# EAGLE schematic Power Supply Gating (EAGLE 9.6.2)
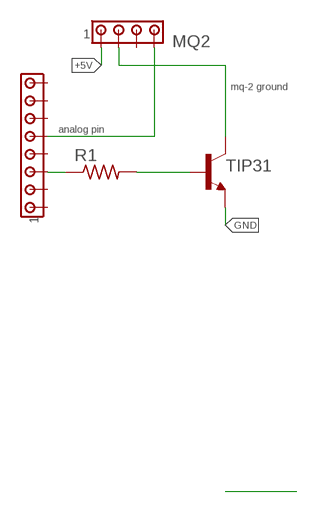
[diagram p0: schematic, sheet 1]

## Parts
MIC_KANAN  MTA08-100  [10X08MTA]
MQ2  MTA04-100  [10X04MTA]
R1  560  R-US_0204/7  [0204/7]
TIP31  2SC1306  [TO220BV]

## Nets
+5V: MQ2.1
ANALOG_PIN: MIC_KANAN.5 MQ2.4
GND: TIP31.3(E)
N$2: MIC_KANAN.3 R1.1
N$16: MQ2.2 TIP31.2(C)
N$19: R1.2 TIP31.1(B)
Unconnected: MIC_KANAN.1 MIC_KANAN.2 MIC_KANAN.4 MIC_KANAN.6 MIC_KANAN.7 MIC_KANAN.8 MQ2.3

## Notes on the sheet
- mq-2 ground
- analog pin

## Library data of the parts
MIC_KANAN = con-amp:MTA08-100: AMP connector
MQ2 = con-amp:MTA04-100: AMP connector
R1 = rcl:R-US_: RESISTOR, American symbol; SPICEPREFIX: R
TIP31 = transistor:2SC1306: NPN Transistor Final RF Power Outupt Source: 2sc1306.pdf